# EAGLE design GIVmon v1.0 (EAGLE 6.2)
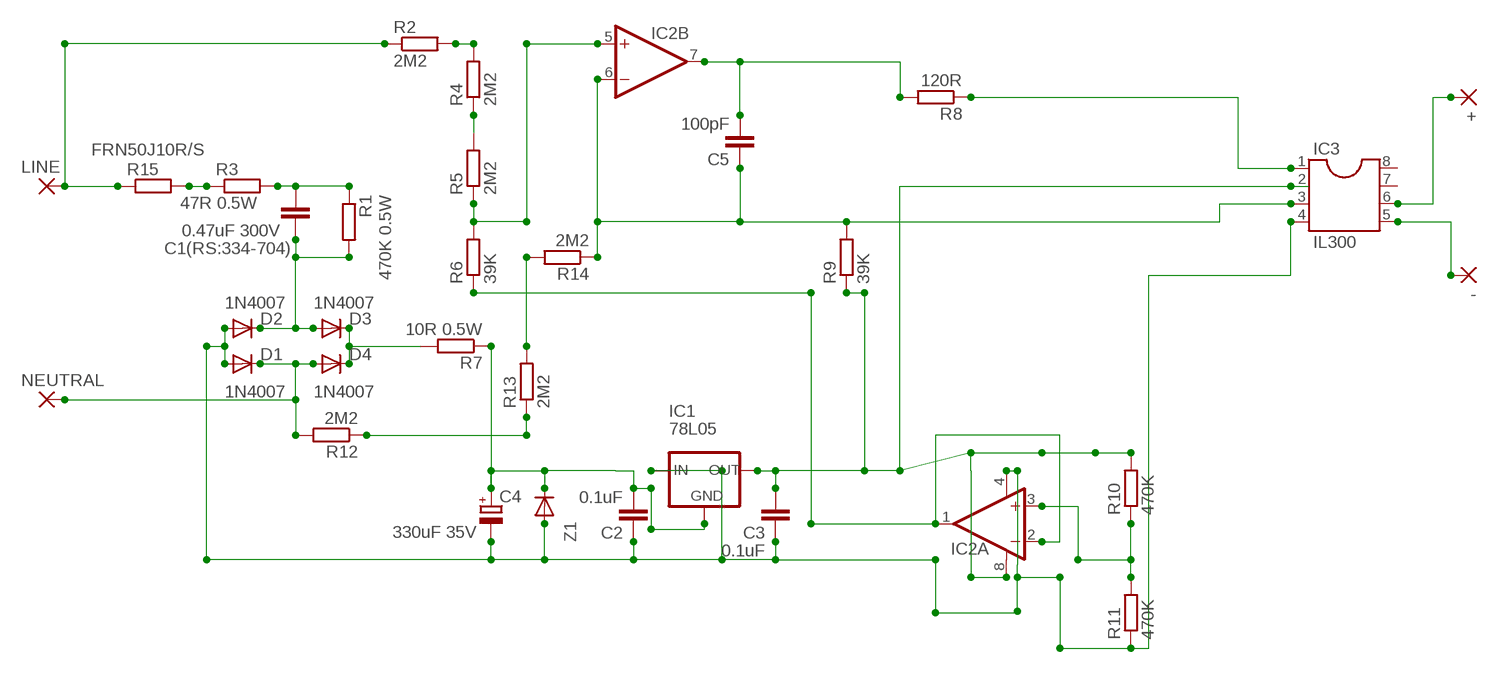
[diagram p0: schematic, sheet 1]

## Parts
+  3,81/1,4  [3,81/1,4]
-  3,81/1,4  [3,81/1,4]
C1(RS:334-704)  0.47uF 300V  C-EU225-108X268  [C225-108X268]
C2  0.1uF  C-EU050-024X044  [C050-024X044]
C3  0.1uF  C-EU050-024X044  [C050-024X044]
C4  330uF 35V  CPOL-EUE5-6  [E5-6]
C5  100pF  C-EU025-024X044  [C025-024X044]
D1  1N4007  DIODEPTH  [DIODE-1N4001]
D2  1N4007  DIODEPTH  [DIODE-1N4001]
D3  1N4007  DIODEPTH  [DIODE-1N4001]
D4  1N4007  DIODEPTH  [DIODE-1N4001]
IC1  78L05  V_REG_78XXTO-92  [TO-92]
IC2  OPAMP-DUALDIP  [DIP08]
IC3  IL300  DIL8  [DIL08]
LINE  3,81/1,4  [3,81/1,4]
NEUTRAL  3,81/1,4  [3,81/1,4]
R1  470K 0.5W  R-EU_0204/7  [0204/7]
R2  2M2  R-EU_0204/7  [0204/7]
R3  47R 0.5W  R-EU_0204/7  [0204/7]
R4  2M2  R-EU_0204/7  [0204/7]
R5  2M2  R-EU_0204/7  [0204/7]
R6  39K  R-EU_0204/7  [0204/7]
R7  10R 0.5W  R-EU_0204/7  [0204/7]
R8  120R  R-EU_0204/7  [0204/7]
R9  39K  R-EU_0204/7  [0204/7]
R10  470K  R-EU_0204/7  [0204/7]
R11  470K  R-EU_0204/7  [0204/7]
R12  2M2  R-EU_0204/7  [0204/7]
R13  2M2  R-EU_0204/7  [0204/7]
R14  2M2  R-EU_0204/7  [0204/7]
R15  FRN50J10R/S  R-EU_0204/7  [0204/7]
Z1  1N59278  DIODEPTH  [DIODE-1N4001]

## Nets
N$1: LINE.1(P) R2.1 R15.1
N$2: D1.C D4.A NEUTRAL.1(P) R12.2
N$3: C1(RS:334-704).2 D2.C D3.A R1.2
N$4: D3.C D4.C R7.2
N$5: C2.2 C4.+ IC1.1(GND) R7.1 Z1.C
N$6: C3.2 IC1.3(OUT) IC2.8(A:V+) IC3.2 R9.1 R10.2
N$7: C2.1 C3.1 C4.- D1.A D2.A IC1.2(IN) IC2.4(A:V-) IC3.4 R11.1 Z1.A
N$8: C1(RS:334-704).1 R1.1 R3.2
N$9: R2.2 R4.2
N$10: IC2.5(B:+IN) R5.1 R6.2
N$11: R3.1 R15.2
N$12: C5.2 IC2.7(B:OUT) R8.2
N$13: C5.1 IC2.6(B:-IN) IC3.3 R9.2 R14.1
N$14: IC2.3(A:+IN) R10.1 R11.2
N$15: -.1(P) IC3.5
N$16: IC2.1(A:OUT) IC2.2(A:-IN) R6.1
N$17: +.1(P) IC3.6
N$18: R12.1 R13.1
N$19: R13.2 R14.2
N$20: IC3.1 R8.1
N$21: R4.1 R5.2
Unconnected: IC3.7 IC3.8

## Library data of the parts
+ - LINE NEUTRAL = wirepad:3,81/1,4: THROUGH-HOLE PAD
C1(RS:334-704) C2 C3 C5 = rcl:C-EU: CAPACITOR, European symbol
C4 = rcl:CPOL-EU: POLARIZED CAPACITOR, European symbol
D1-D4 Z1 = SparkFun-DiscreteSemi:DIODE: Diode These are standard reverse protection diodes and small signal diodes. SMA package can handle up to about 1A. SOD-323 can handle about 200mA. What the SOD-323 package when ordering, there are some mfgs out there that are 5-pin packages.
IC1 = SparkFun-PowerIC:V_REG_78XX: Voltage Regulator Standard 7805 5V regulator. IGO (Input Ground Output). Spark Fun Electronics SKU : COM-00107
IC2 = SparkFun-AnalogIC:OPAMP-DUAL: Generic op-amp footprint
IC3 = ic-package:DIL8: Dual In Line / Socket
R1-R15 = resistor:R-EU_: RESISTOR, European symbol

## Board
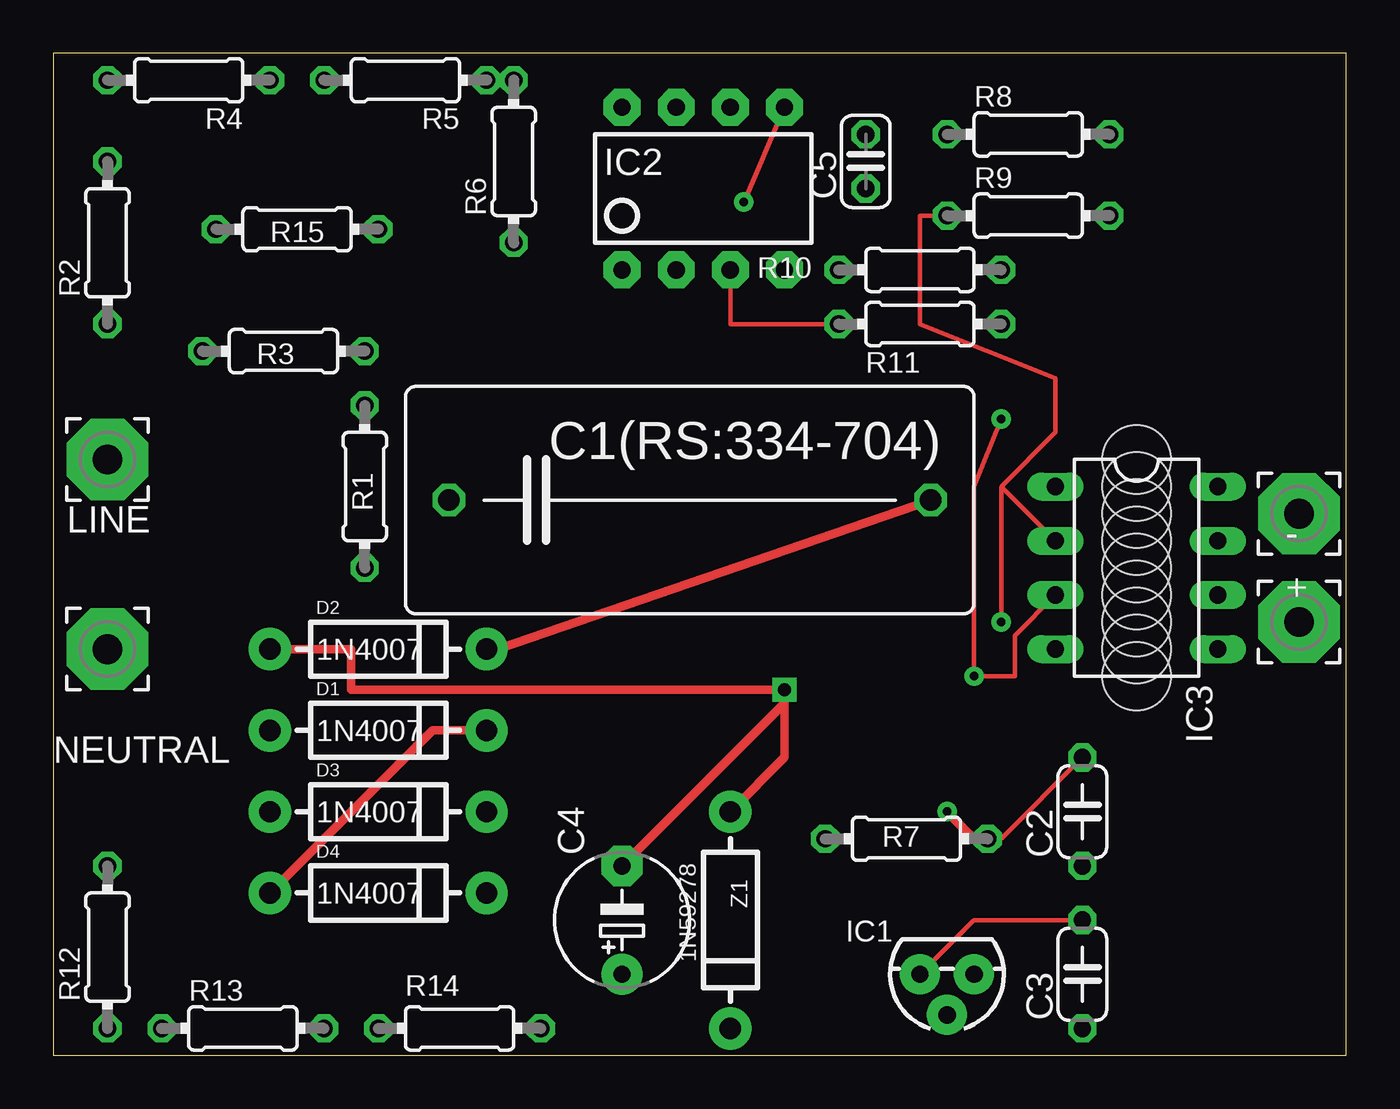
[diagram p1: board, top side]
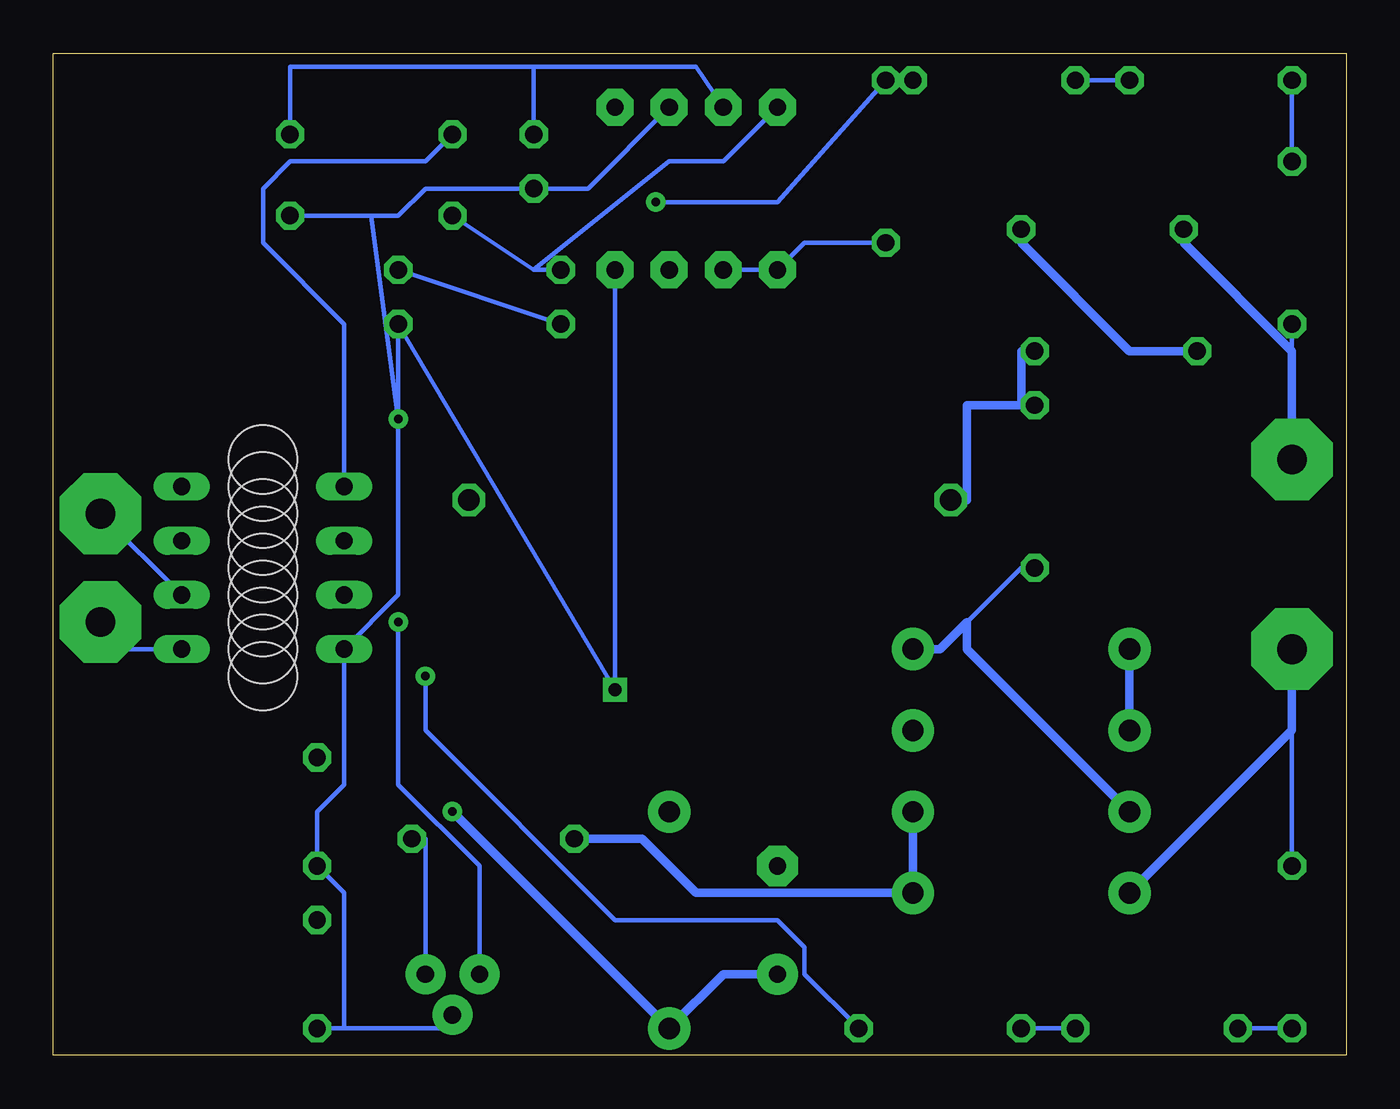
[diagram p2: board, bottom side, seen from below]

Size 60.63 x 46.98 mm. Coordinates in mm from the lower left corner, seen from the top.
Outline: 0,0 60.63,0 60.63,46.98 0,46.98 0,0
Copper layers (1*16): Top 0.035mm / dielectric 1.5mm / Bottom 0.035mm
Design rules: minimum track width 0.2mm, minimum drill 0.4mm, track to track 0.2mm, track to pad 0.2mm, pad to pad 0.2mm, via to via 0.2mm, smd to smd 0mil, copper to edge 10mil, drill to drill 0.2mm, minimum pad ring 10mil, minimum via ring 10mil, stop-mask expansion 0.125mm, vias tented up to drill 0mil, thermal gap 10mil
Holes 3.2 mm at 50.8,26.67 50.8,25.4 50.8,24.13 50.8,22.86 50.8,21.59 50.8,20.32 50.8,19.05 50.8,17.78 50.8,27.94

### Footprints (pad centres in the part's own frame; a part is rotated, then mirrored left to right if it is on the bottom)
3,81/1,4 = drill 1.397 pad 3.81 octagon: 1 0,0
C225-108X268 = drill 1.016 octagon: 1 -11.303,0; 2 11.303,0
C050-024X044 = drill 0.813 octagon: 1 -2.54,0; 2 2.54,0
E5-6 = drill 0.813 pad 1.905: + -2.54,0 | drill 0.813 pad 1.905 octagon: - 2.54,0
C025-024X044 = drill 0.813 octagon: 1 -1.27,0; 2 1.27,0
DIODE-1N4001 = drill 1 pad 1.981: A -5.08,0; C 5.08,0
TO-92 = drill 0.813 pad 1.88: 1 -1.27,0; 2 0,1.905; 3 1.27,0
DIP08 = drill 0.813 pad 1.727 octagon: 1 -3.81,-3.81; 2 -1.27,-3.81; 3 1.27,-3.81; 4 3.81,-3.81; 5 3.81,3.81; 6 1.27,3.81; 7 -1.27,3.81; 8 -3.81,3.81
DIL08 = drill 0.813 long: 1 -3.81,-3.81; 2 -1.27,-3.81; 3 1.27,-3.81; 4 3.81,-3.81; 5 3.81,3.81; 6 1.27,3.81; 7 -1.27,3.81; 8 -3.81,3.81
0204/7 = drill 0.813 octagon: 1 -3.81,0; 2 3.81,0

### Placement (x,y rotation side)
+  58.42,25.4 0 top
-  58.42,20.32 0 top
C1(RS:334-704)  29.84,26.04 0 top
C2  48.26,11.43 90 top
C3  48.26,3.81 90 top
C4  26.67,6.35 90 top
C5  38.1,41.91 90 top
D1  15.24,15.24 0 top
D2  15.24,19.05 0 top
D3  15.24,11.43 0 top
D4  15.24,7.62 0 top
IC1  41.91,3.81 180 top
IC2  30.48,40.64 0 top
IC3  50.8,22.86 270 top
LINE  2.54,27.94 0 top
NEUTRAL  2.54,19.05 0 top
R1  14.61,26.67 270 top
R2  2.54,38.1 90 top
R3  10.79,33.02 0 top
R4  6.35,45.72 180 top
R5  16.51,45.72 180 top
R6  21.59,41.91 90 top
R7  40.01,10.16 180 top
R8  45.72,43.18 0 top
R9  45.72,39.37 0 top
R10  40.64,36.83 180 top
R11  40.64,34.29 180 top
R12  2.54,5.08 90 top
R13  8.89,1.27 0 top
R14  19.05,1.27 180 top
R15  11.43,38.73 0 top
Z1  31.75,6.35 270 top

### Tracks (layer width: path | path; a pad name or v marks a point on that pad's centre or on a via)
N$1
  Bottom 0.2: 2.54,33.02 R2.1
  Bottom 0.4: LINE.1 2.54,33.02 7.62,38.1 R15.1
N$2
  Top 0.4: D1.C 17.78,15.24 D4.A
  Bottom 0.2: 2.54,15.24 R12.2
  Bottom 0.4: NEUTRAL.1 2.54,15.24 D4.A
N$3
  Top 0.406: D2.C 20.83,19.05 C1(RS:334-704).2
  Bottom 0.2: 17.78,20.32 15.24,22.86 R1.2
  Bottom 0.4: D2.C 19.05,19.05 17.78,20.32 17.78,19.05 D3.A
N$4
  Bottom 0.2: 35.56,10.16 R7.2
  Bottom 0.4: 35.56,10.16 33.02,10.16 30.48,7.62 D4.C D3.C
N$5  (via drill 0.4)
  Top 0.2: C2.2 44.45,10.16 R7.1
  Top 0.4: v41.91,11.43 43.18,10.16 R7.1
  Bottom 0.2: IC1.1 43.18,10.16 R7.1
  Bottom 0.4: C4.+ 29.21,3.81 Z1.C v41.91,11.43
N$6  (via drill 0.4)
  Top 0.2: C3.2 43.18,6.35 IC1.3 | 44.45,26.67 IC3.2 | 44.45,26.67 46.99,29.21 46.99,31.75 40.64,34.29 40.64,36.83 40.64,39.37 R9.1 | 44.45,26.67 v44.45,20.32
  Bottom 0.2: R9.1 38.1,36.83 | 38.1,36.83 R10.2 | IC2.8 29.21,41.91 31.75,41.91 38.1,36.83 | IC1.3 40.64,8.89 44.45,12.7 v44.45,20.32
N$7  (via drill 0.6)
  Top 0.4: 34.29,16.51 34.29,13.97 Z1.A | 34.29,16.51 v34.29,17.14 13.97,17.14 13.97,19.05 12.7,19.05 D2.A | 34.29,16.51 C4.-
  Bottom 0.2: 46.99,1.27 41.91,1.27 IC1.2 | 46.99,1.27 C3.1 | 46.99,1.27 46.99,7.62 C2.1 48.26,11.43 46.99,12.7 IC3.4 44.45,21.59 R11.1 v34.29,17.14 IC2.4
  Bottom 0.4: D2.A D1.A
N$8
  Bottom 0.4: R1.1 15.24,30.48 15.24,33.02 R3.2
  Bottom 0.406: C1(RS:334-704).1 17.78,26.04 17.78,30.48 15.24,30.48
N$9
  Bottom 0.2: R4.2 R2.2
N$10  (via drill 0.4)
  Top 0.2: IC2.5 v32.38,40.01
  Bottom 0.2: R5.1 R6.2 26.67,40.01 v32.38,40.01
N$11
  Bottom 0.2: 15.24,38.1 R15.2
  Bottom 0.4: 15.24,38.1 10.16,33.02 7.62,33.02 R3.1
N$12
  Bottom 0.2: 38.1,46.35 35.56,46.35 30.48,46.35 IC2.7 | 38.1,46.35 C5.2 | R8.2 49.53,46.35 44.45,46.35 38.1,46.35
N$13  (via drill 0.4)
  Top 0.2: IC3.3 45.09,19.68 45.09,17.78 v43.18,17.78 43.18,26.67 v44.45,29.84
  Bottom 0.2: IC2.6 35.56,40.64 C5.1 43.18,40.64 44.45,39.37 45.72,39.37 | 45.72,39.37 R9.2 | R14.1 25.4,3.81 25.4,5.08 26.67,6.35 34.29,6.35 43.18,15.24 v43.18,17.78 | v44.45,29.84 45.72,39.37
N$14
  Top 0.2: IC2.3 31.75,34.29 34.29,34.29 35.56,34.29 R11.2
  Bottom 0.2: R10.1 R11.2
N$15
  Bottom 0.2: IC3.5 57.15,19.05 -.1
N$16
  Bottom 0.2: R6.1 25.4,38.1 IC2.1 IC2.2
N$17
  Bottom 0.2: +.1 IC3.6
N$18
  Bottom 0.2: R13.1 R12.1
N$19
  Bottom 0.2: R14.2 R13.2
N$20
  Bottom 0.2: IC3.1 46.99,34.29 50.8,38.1 50.8,40.64 49.53,41.91 43.18,41.91 R8.1
N$21
  Bottom 0.2: R5.2 R4.1